# Altium schematic sheet CLP_v1.2_Sch.SchDoc
size A3
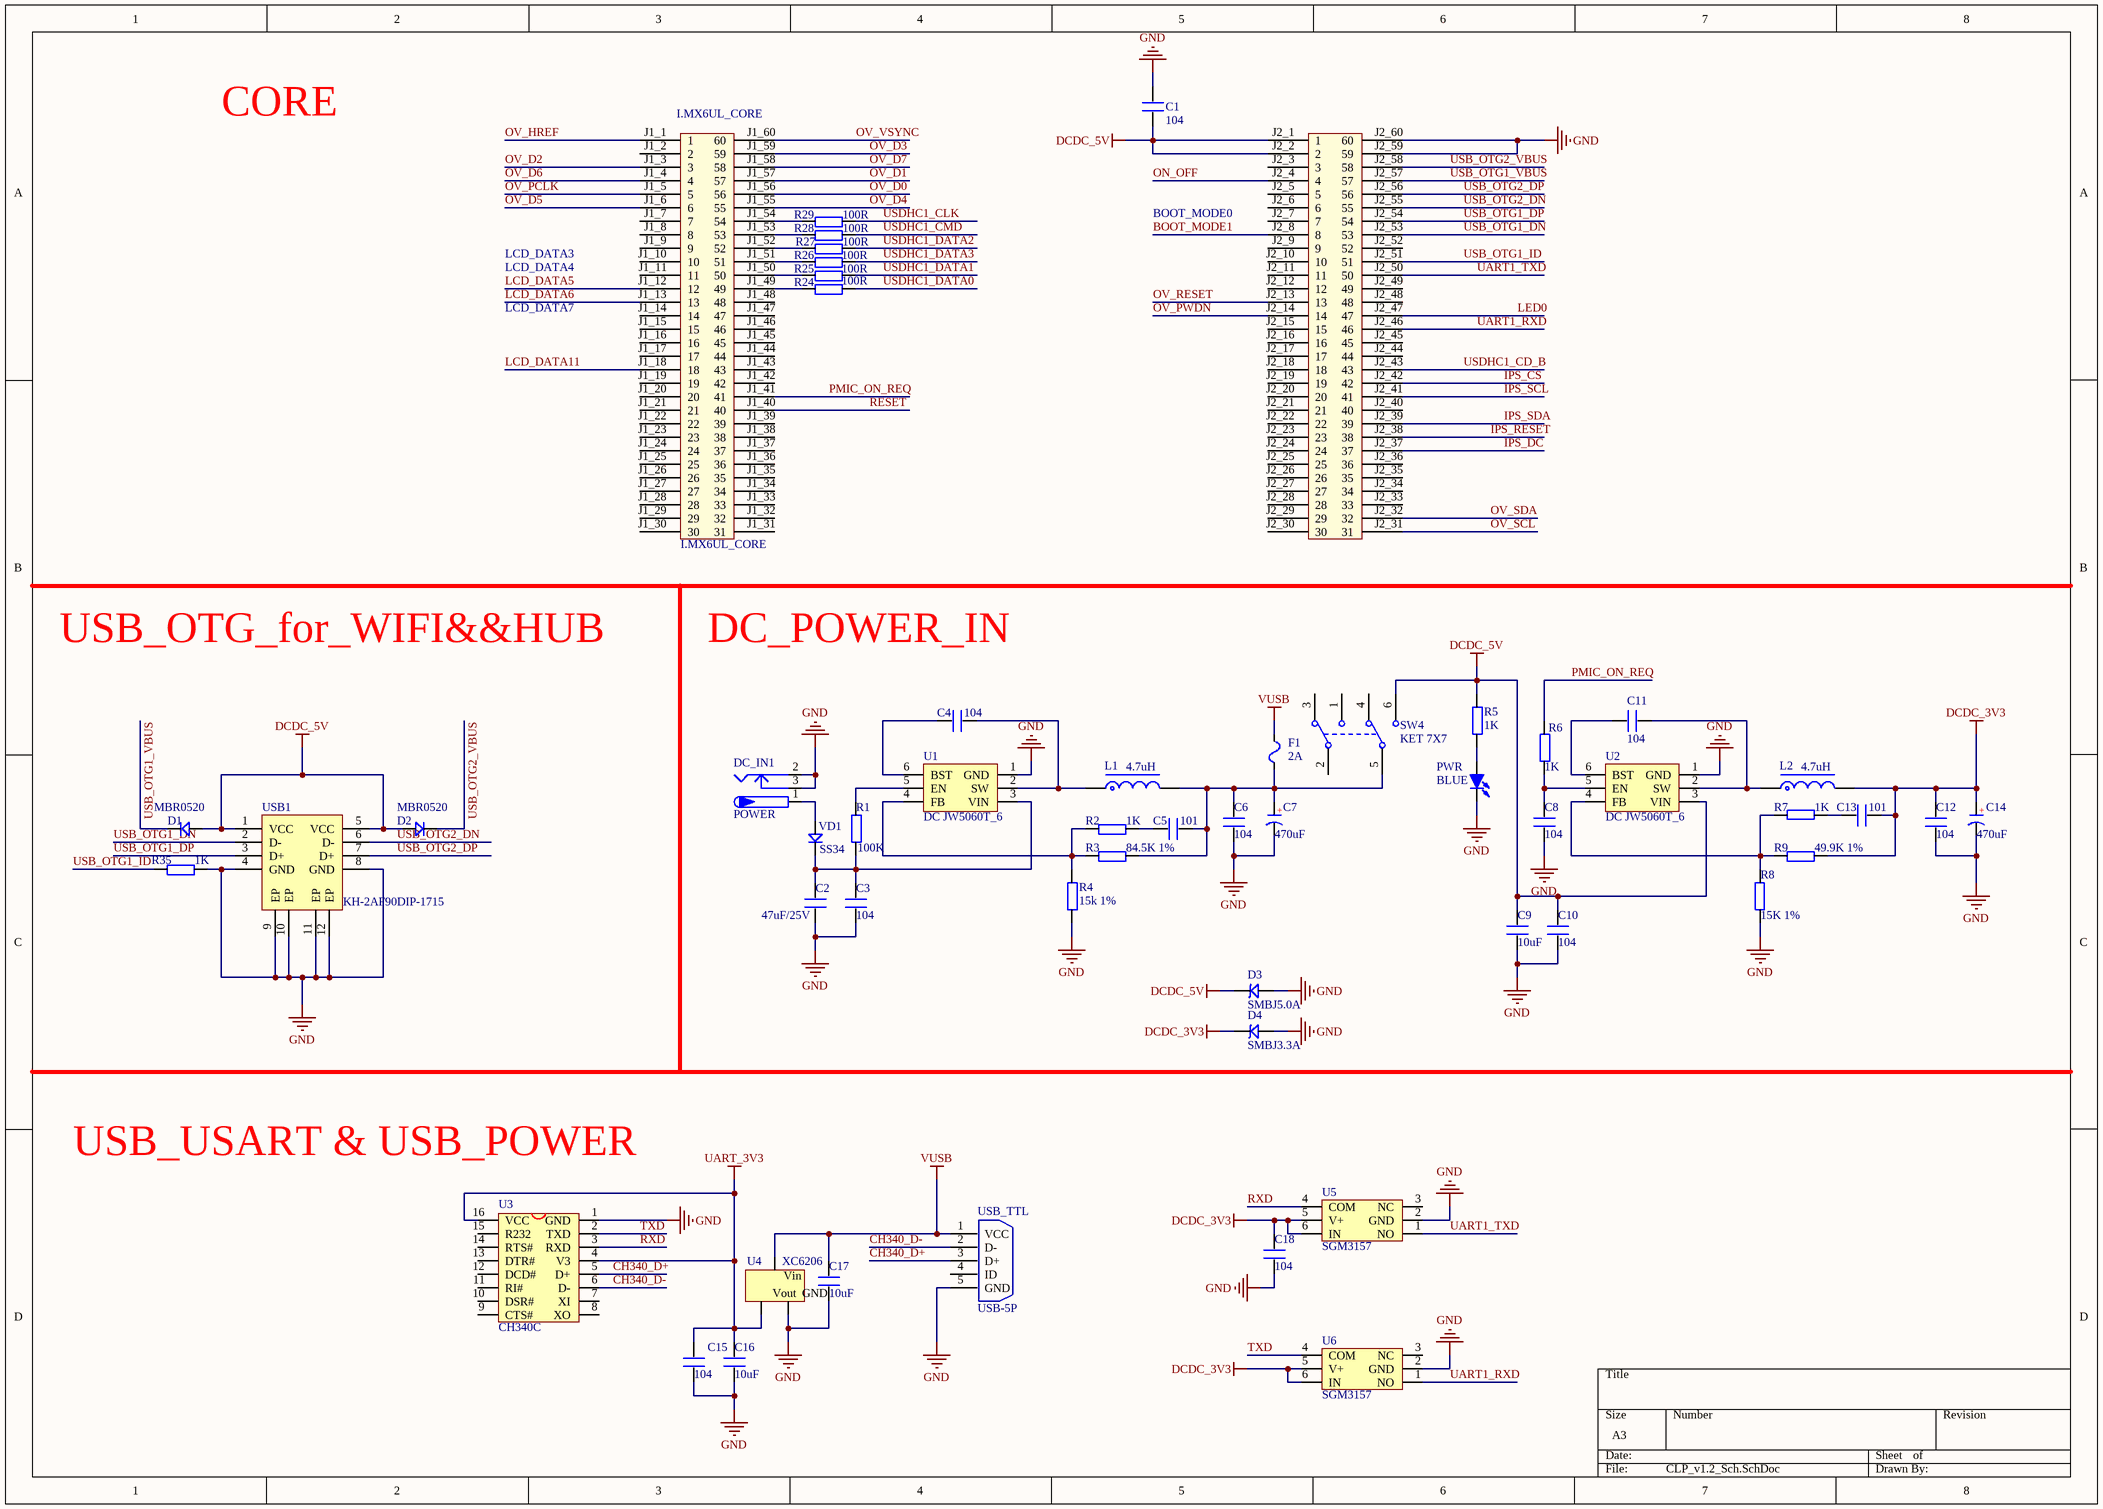
[diagram p0: CLP_v1.2_Sch.SchDoc]

## Parts
C1  104  [C 0603]
C2  47uF/25V  [1206]
C3  104  [C 0603]
C4  104  [C 0603]
C5  101  [C 0603]
C6  104  [C 0603]
C7  470uF  [CM D(6.3*7.7)]
C8  104  [C 0603]
C9  10uF  [C 0603]
C10  104  [C 0603]
C11  104  [C 0603]
C12  104  [C 0603]
C13  101  [C 0603]
C14  470uF  [CM D(6.3*7.7)]
C15  104  [C 0603]
C16  10uF  [C 0603]
C17  10uF  [C 0603]
C18  104  [C 0603]
D1  MBR0520  [SOD-123F]
D2  MBR0520  [SOD-123F]
D3  SMBJ5.0A  [SMBJ]
D4  SMBJ3.3A  [SMBJ]
DC_IN1  POWER  [DC10B]
F1  2A  [FU 1206]
I.MX6UL_CORE  I.MX6UL_CORE  [I.MX6UL_CORE]
L1  4.7uH  [L-SMD-0420]
L2  4.7uH  [L-SMD-0420]
PWR  BLUE  [LED 0805R]
R1  100K  [R 0603]
R2  1K  [R 0603]
R3  84.5K 1%  [R 0603]
R4  15k 1%  [R 0603]
R5  1K  [R 0603]
R6  1K  [R 0603]
R7  1K  [R 0603]
R8  15K 1%  [R 0603]
R9  49.9K 1%  [R 0603]
R24  100R  [R 0603]
R25  100R  [R 0603]
R26  100R  [R 0603]
R27  100R  [R 0603]
R28  100R  [R 0603]
R29  100R  [R 0603]
R35  1K  [R 0603]
SW4  KET 7X7  [KFT DIP-7X7]
U1  DC JW5060T_6  [SOT23-6N]
U2  DC JW5060T_6  [SOT23-6N]
U3  CH340C  [SOP16_N]
U4  XC6206  [SOT23-3N]
U5  SGM3157  [SOT363-6L]
U6  SGM3157  [SOT363-6L]
USB1  KH-2AF90DIP-1715  [USB_HOST]
USB_TTL  USB-5P  [USB-MINI-A]
VD1  SS34  [SOD-123F]

## Nets
DCDC_3V3: C12.1 C13.1 C14.1(A) C18.2 D4.2 L2.2 R9.2 U5.5(V+) U5.6(IN) U6.5(V+) U6.6(IN)
DCDC_5V: C1.1 C9.2 C10.2 D1.1(A) D2.1(A) D3.2 I.MX6UL_CORE.J2_1(1) I.MX6UL_CORE.J2_2(2) R5.2 SW4.6(NC2) U2.3(VIN) USB1.1(VCC) USB1.5(VCC)
GND: C1.2 C2.2 C3.2 C6.1 C7.2(K) C8.1 C9.1 C10.1 C12.2 C14.2(K) C15.1 C16.1 C17.1 C18.1 D3.1 D4.1 DC_IN1.2 DC_IN1.3 I.MX6UL_CORE.J2_59(59) I.MX6UL_CORE.J2_60(60) PWR.2(K) R4.1 R8.2 R35.2 U1.1(GND) U2.1(GND) U3.1(GND) U4.1(GND) U5.2(GND) U6.2(GND) USB1.4(GND) USB1.8(GND) USB1.9(EP) USB1.10(EP) USB1.11(EP) USB1.12(EP) USB_TTL.5(GND)
UART_3V3: C15.2 C16.2 U3.4(V3) U3.16(VCC) U4.2(Vout)
VUSB: C17.2 F1.2 U4.3(Vin) USB_TTL.1(VCC)
BOOT_MODE1: I.MX6UL_CORE.J2_8(8)
CH340_D+: U3.5(D+) USB_TTL.3(D+)
CH340_D-: U3.6(D-) USB_TTL.2(D-)
IPS_CS: I.MX6UL_CORE.J2_42(42)
IPS_DC: I.MX6UL_CORE.J2_37(37)
IPS_RESET: I.MX6UL_CORE.J2_38(38)
IPS_SCL: I.MX6UL_CORE.J2_41(41)
IPS_SDA: I.MX6UL_CORE.J2_39(39)
LCD_DATA5: I.MX6UL_CORE.J1_12(12)
LCD_DATA6: I.MX6UL_CORE.J1_13(13)
LCD_DATA11: I.MX6UL_CORE.J1_18(18)
LED0: I.MX6UL_CORE.J2_47(47)
ON_OFF: I.MX6UL_CORE.J2_4(4)
OV_D0: I.MX6UL_CORE.J1_56(56)
OV_D1: I.MX6UL_CORE.J1_57(57)
OV_D2: I.MX6UL_CORE.J1_3(3)
OV_D3: I.MX6UL_CORE.J1_59(59)
OV_D4: I.MX6UL_CORE.J1_55(55)
OV_D5: I.MX6UL_CORE.J1_6(6)
OV_D6: I.MX6UL_CORE.J1_4(4)
OV_D7: I.MX6UL_CORE.J1_58(58)
OV_HREF: I.MX6UL_CORE.J1_1(1)
OV_PCLK: I.MX6UL_CORE.J1_5(5)
OV_PWDN: I.MX6UL_CORE.J2_14(14)
OV_RESET: I.MX6UL_CORE.J2_13(13)
OV_SCL: I.MX6UL_CORE.J2_31(31)
OV_SDA: I.MX6UL_CORE.J2_32(32)
OV_VSYNC: I.MX6UL_CORE.J1_60(60)
PMIC_ON_REQ: I.MX6UL_CORE.J1_41(41) R6.2
RESET: I.MX6UL_CORE.J1_40(40)
RXD: U3.3(RXD) U5.4(COM)
TXD: U3.2(TXD) U6.4(COM)
UART1_RXD: I.MX6UL_CORE.J2_46(46) U6.1(NO)
UART1_TXD: I.MX6UL_CORE.J2_50(50) U5.1(NO)
USB_OTG1_DN: I.MX6UL_CORE.J2_53(53) USB1.2(D-)
USB_OTG1_DP: I.MX6UL_CORE.J2_54(54) USB1.3(D+)
USB_OTG1_ID: I.MX6UL_CORE.J2_51(51) R35.1
USB_OTG1_VBUS: D1.2(K) I.MX6UL_CORE.J2_57(57)
USB_OTG2_DN: I.MX6UL_CORE.J2_55(55) USB1.6(D-)
USB_OTG2_DP: I.MX6UL_CORE.J2_56(56) USB1.7(D+)
USB_OTG2_VBUS: D2.2(K) I.MX6UL_CORE.J2_58(58)
USDHC1_CD_B: I.MX6UL_CORE.J2_43(43)
USDHC1_CLK: R29.2
USDHC1_CMD: R28.2
USDHC1_DATA0: R24.2
USDHC1_DATA1: R25.2
USDHC1_DATA2: R27.2
USDHC1_DATA3: R26.2
NetC2_1: C2.1 C3.1 R1.1 U1.3(VIN) VD1.2(K)
NetC4_1: C4.1 U1.6(BST)
NetC4_2: C4.2 L1.1 U1.2(SW)
NetC5_1: C5.1 R2.2
NetC5_2: C5.2 C6.2 C7.1(A) F1.1 L1.2 R3.2 SW4.5(COM2)
NetC8_2: C8.2 R6.1 U2.5(EN)
NetC11_1: C11.1 L2.1 U2.2(SW)
NetC11_2: C11.2 U2.6(BST)
NetC13_2: C13.2 R7.1
NetDC_IN1_1: DC_IN1.1 VD1.1(A)
NetI.MX6UL_CORE_J1_49: I.MX6UL_CORE.J1_49(49) R24.1
NetI.MX6UL_CORE_J1_50: I.MX6UL_CORE.J1_50(50) R25.1
NetI.MX6UL_CORE_J1_51: I.MX6UL_CORE.J1_51(51) R26.1
NetI.MX6UL_CORE_J1_52: I.MX6UL_CORE.J1_52(52) R27.1
NetI.MX6UL_CORE_J1_53: I.MX6UL_CORE.J1_53(53) R28.1
NetI.MX6UL_CORE_J1_54: I.MX6UL_CORE.J1_54(54) R29.1
NetPWR_1: PWR.1(A) R5.1
NetR1_2: R1.2 U1.5(EN)
NetR2_1: R2.1 R3.1 R4.2 U1.4(FB)
NetR7_2: R7.2 R8.1 R9.1 U2.4(FB)

Not connected (* = marked no-connect by the designer): I.MX6UL_CORE J1_2(2) J1_7(7) J1_8(8) J1_9(9) J1_10(10) J1_11(11) J1_14(14) J1_15(15) J1_16(16) J1_17(17) J1_19(19) J1_20(20) J1_21(21) J1_22(22) J1_23(23) J1_24(24) J1_25(25) J1_26(26) J1_27(27) J1_28(28) J1_29(29) J1_30(30) J1_31(31) J1_32(32) J1_33(33) J1_34(34) J1_35(35) J1_36(36) J1_37(37) J1_38(38) J1_39(39) J1_42(42) J1_43(43) J1_44(44) J1_45(45) J1_46(46) J1_47(47) J1_48(48) J2_3(3) J2_5(5) J2_6(6) J2_7(7) J2_9(9) J2_10(10) J2_11(11) J2_12(12) J2_15(15) J2_16(16) J2_17(17) J2_18(18) J2_19(19) J2_20(20) J2_21(21) J2_22(22) J2_23(23) J2_24(24) J2_25(25) J2_26(26) J2_27(27) J2_28(28) J2_29(29) J2_30(30) J2_33(33) J2_34(34) J2_35(35) J2_36(36) J2_40(40) J2_44(44) J2_45(45) J2_48(48) J2_49(49) J2_52(52); SW4 1(NC1) 2(COM2) 3(NO1) 4(NO2); U3 7(XI) 8(XO) 9(CTS#) 10(DSR#) 11(RI#) 12(DCD#) 13(DTR#) 14(RTS#) 15(R232); U5 3(NC); U6 3(NC); USB_TTL 4(ID)

## Notes on the sheet
- CORE
- (near I.MX6UL_CORE) BOOT_MODE0
- LCD_DATA3
- LCD_DATA4
- LCD_DATA7
- USB_OTG_for_WIFI&&HUB
- DC_POWER_IN
- USB_USART & USB_POWER
- (in symbol C-CM) +

## Library data of the parts
C1-C6 C8-C13 C15-C18 = C
C7 C14 = C-CM: 贴片电解电容; 版权归属: 源创客; BOM名称: 贴片电解电容; 学习资源: www.ooocke.com
D1 D2 VD1 = SS14: 肖特基二极管; 版权归属: 源创客; 属性: 40V/1A; BOM名称: 肖特基二极管; 学习资源: www.ooocke.com
D3 D4 = SMBJ: TVS
DC_IN1 = P-DC: 低压电源接口; BOM名称: DC电源接口; 版权归属: 源创客; 学习资源: www.ooocke.com
F1 = FU: 贴片保险丝; 版权归属: 源创客; BOM名称: 贴片保险丝; 学习资源: www.ooocke.com
I.MX6UL_CORE = I.MX6UL核心板
L1 L2 = L-CDRH: 功率屏蔽电感; 版权归属: 源创客; BOM名称: 功率屏蔽电感; 学习资源: www.ooocke.com
PWR = LED-SMD: 贴片LED; 版权归属: 源创客; BOM名称: 贴片LED; 学习资源: www.ooocke.com
R1-R9 R24-R29 R35 = R
SW4 = KET 7X7: 7*7自锁开关; 版权归属: 黎明电子style; BOM名称: 7*7自锁开关; 学习资源: https://lmdzstyle.taobao.com/
U1 U2 = DC JW5060T_6: DC降压芯片
U3 = CH340G: USB2UART
U4 = LDO XC6206: LDO; ComponentLink1Description: 供应商链接; ComponentLink1URL: http://www.szlcsc.com/product/details_5896.html; Package: SOT-23; Supplier: LC; SuppliersPartNumber: C5446
U5 U6 = SGM3157: 单路双掷模拟开关
USB1 = USB_HOST: WIFI && USB_HUB
USB_TTL = USB-5P: 微型USB母座; 版权归属: 源创客; BOM名称: 微型USB母座; 学习资源: www.ooocke.com